# EAGLE design ai_breakout_adns3080 (EAGLE 6.5.0)
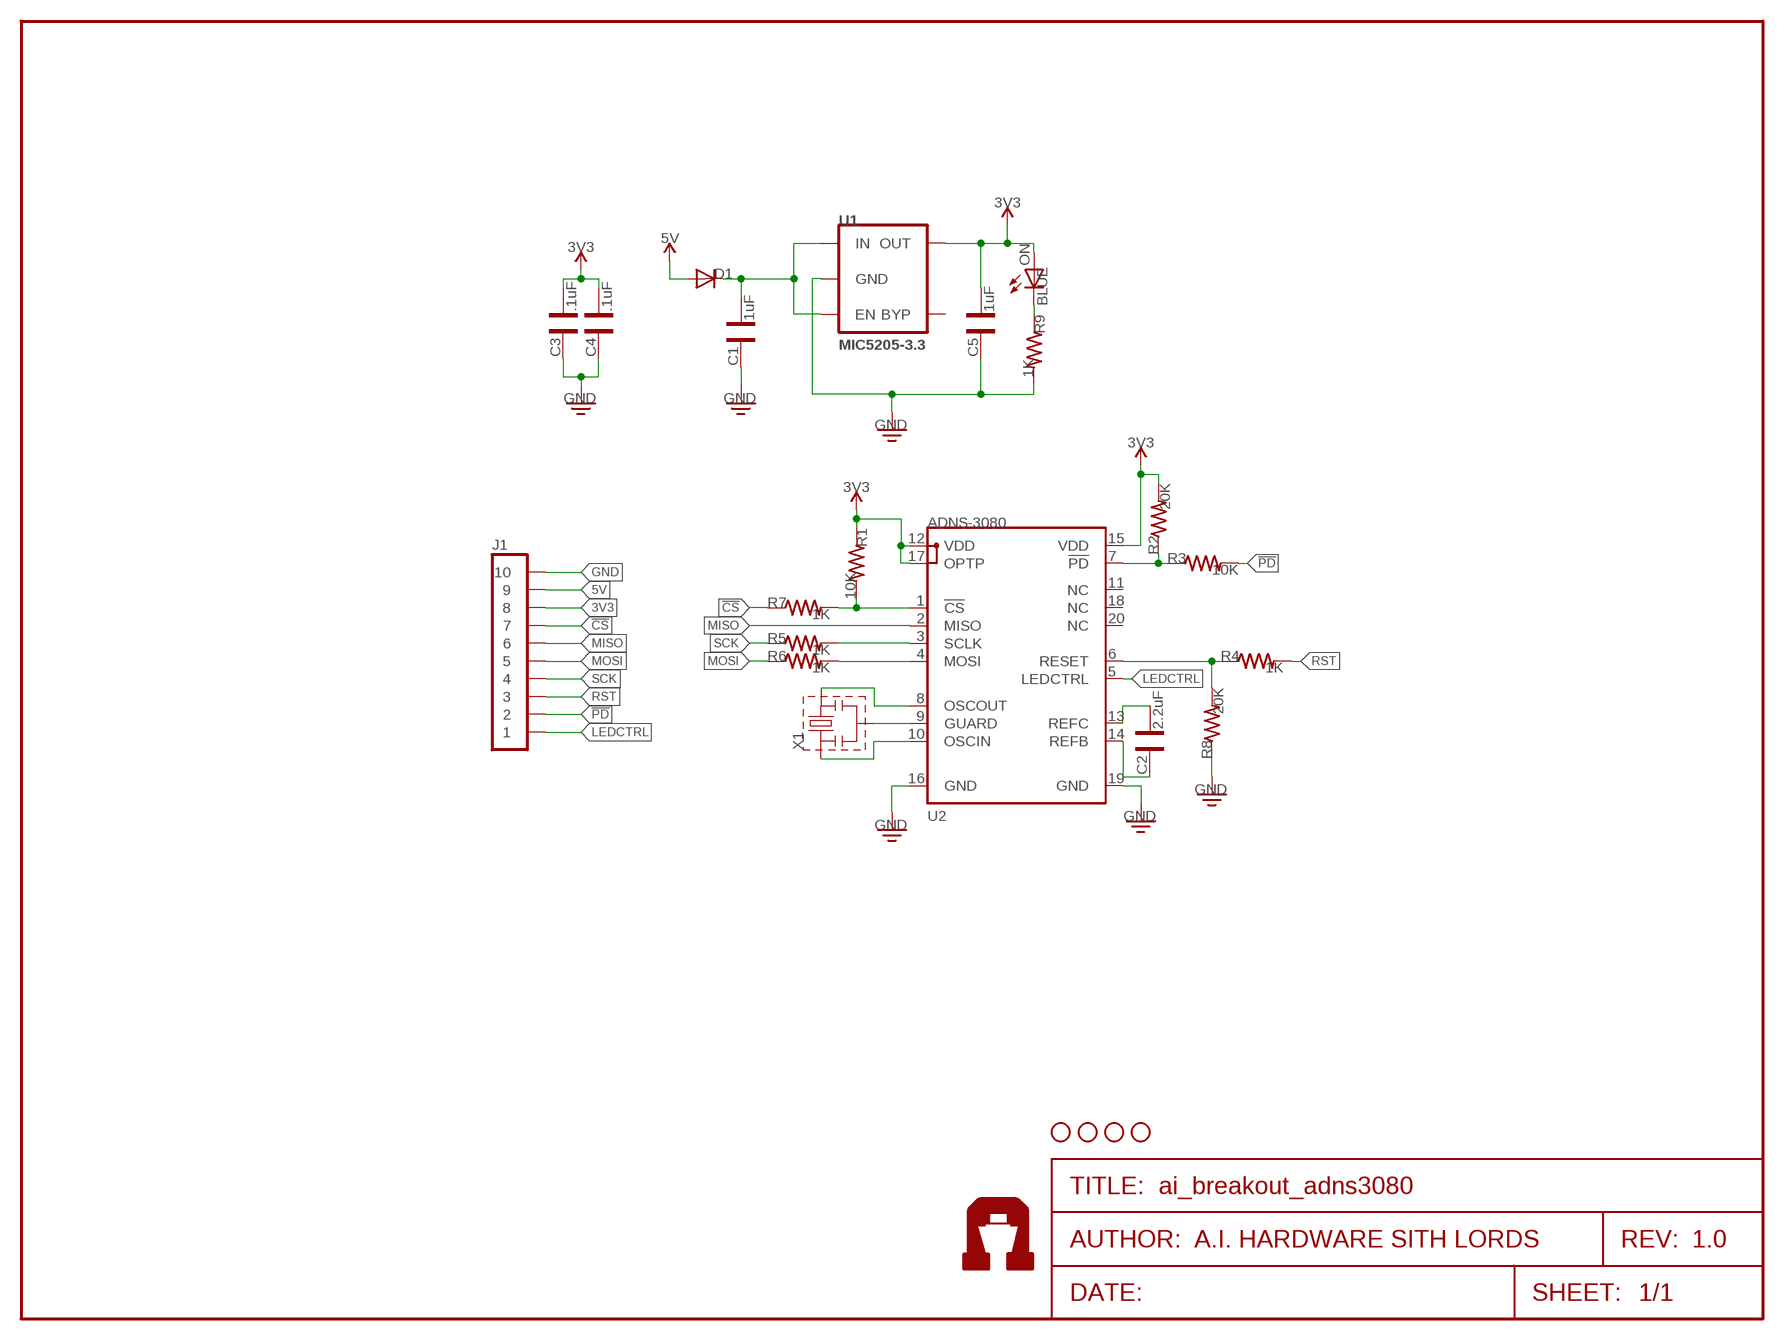
[diagram p0: schematic, sheet 1]
FRAME1 (FRAME-LETTER): AUTHOR: A.I. HARDWARE SITH LORDS; REV: 1.0

## Parts
C1  1uF  CAP0603  [CAP-0603]
C2  2.2uF  CAP0603  [CAP-0603]
C3  .1uF  CAP0603  [CAP-0603]
C4  .1uF  CAP0603  [CAP-0603]
C5  1uF  CAP0603  [CAP-0603]
D1  DIODESMA-403D  [SMA-403D]
J1  1X10  [1X10]
ON  BLUE  LED0603  [LED-0603]
R1  10K  RES0603  [RES-0603]
R2  20K  RES0603  [RES-0603]
R3  10K  RES0603  [RES-0603]
R4  1K  RES0603  [RES-0603]
R5  1K  RES0603  [RES-0603]
R6  1K  RES0603  [RES-0603]
R7  1K  RES0603  [RES-0603]
R8  20K  RES0603  [RES-0603]
R9  1K  RES0603  [RES-0603]
STANDOFF1  STAND-OFF  [STAND-OFF]
STANDOFF2  STAND-OFF  [STAND-OFF]
STANDOFF3  STAND-OFF  [STAND-OFF]
STANDOFF4  STAND-OFF  [STAND-OFF]
U1  MIC5205-3.3  [SOT23-5]
U2  ADNS-3080  [ADNS-3080]
U$2  AI-LOGOM  [AI-LOGO-M]
U$3  AI-LOGOM  [AI-LOGO-M]
X1  RESON025X020  [RESON-SMD-025X020]

## Nets
3V3: C3.1 C4.1 C5.1 J1.8 ON.A R1.1 R2.2 U1.5(OUT) U2.12(VDD) U2.15(VDD) U2.17(OPTP)
5V: D1.A J1.9
!CS: J1.7 R7.1
!PD: J1.2 R3.2
GND: C1.2 C3.2 C4.2 C5.2 J1.10 R8.1 R9.2 U1.2(GND) U2.16(GND) U2.19(GND)
LEDCTRL: J1.1 U2.5(LEDCTRL)
MISO: J1.6 U2.2(MISO)
MOSI: J1.5 R6.1
N$1: C1.1 D1.C U1.1(IN) U1.3(EN)
N$2: U2.9(GUARD) X1.2
N$3: U2.8(OSCOUT) X1.3
N$4: R1.2 R7.2 U2.1(!CS)
N$5: R5.2 U2.3(SCLK)
N$6: U2.10(OSCIN) X1.1
N$7: R2.1 R3.1 U2.7(!PD)
N$10: R6.2 U2.4(MOSI)
N$12: R4.1 R8.2 U2.6(RESET)
N$16: C2.1 U2.13(REFC)
N$17: C2.2 U2.14(REFB)
N$26: ON.C R9.1
RST: J1.3 R4.2
SCK: J1.4 R5.1
Unconnected: U1.4(BYP) U2.11(NC) U2.18(NC) U2.20(NC)

## Library data of the parts
C1-C5 = Ai_Passives:CAP
D1 = Ai_DiscreteSemis:DIODE
J1 = Ai_Connectors:1X10
ON = Ai_LED:LED
R1-R9 = Ai_Passives:RES
STANDOFF1-STANDOFF4 = Ai_Electromechanical:STAND-OFF: #4 Stand Off This is the mechanical footprint for a #4 phillips button head screw. Use the keepout ring to avoid running the screw head into surrounding components.
U1 = Ai_Power:MIC5205-*: Fixed-Voltage Regulator Standard voltage regulator in SOT23-5 layout. Micrel part MIC5205x.x where x.x designates the output voltage (e.g., 3.3). BYP pin is used to lower output noise with 470pF cap. Haven't tested the footprint on an actual board yet!
U2 = Ai_IC:ADNS-3080
U$2 U$3 = Ai_Miscellany:AI-LOGO
X1 = Ai_Passives:RESON

## Net classes
0 default: width 0.305 mm
1 power: width 0.406 mm

## Board
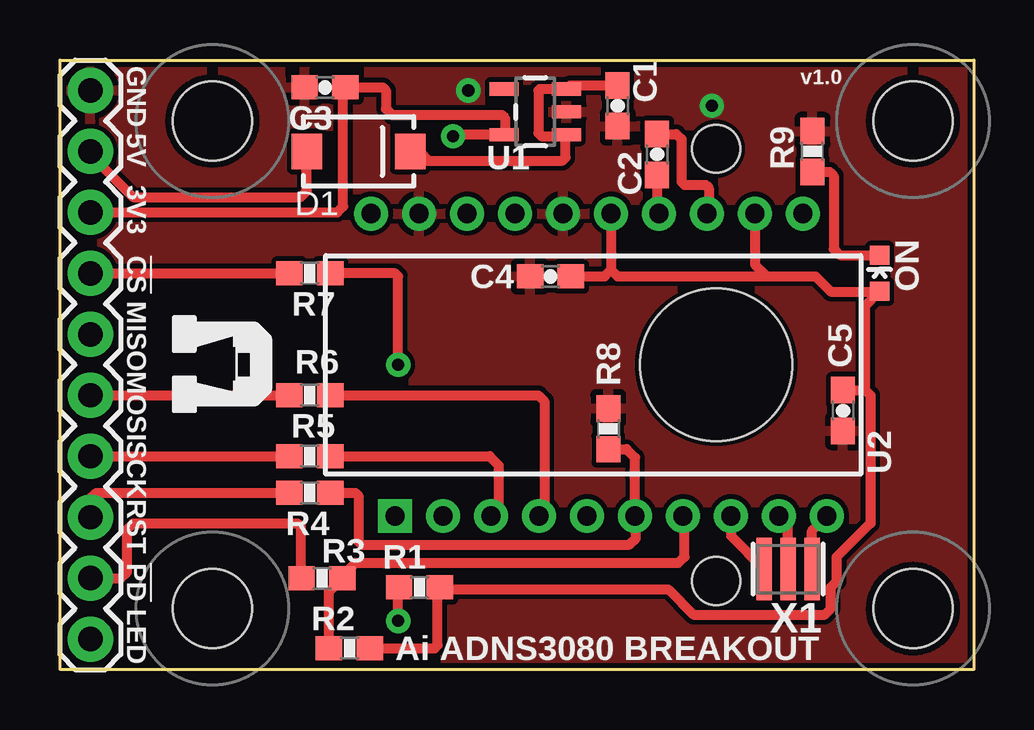
[diagram p1: board, top side]
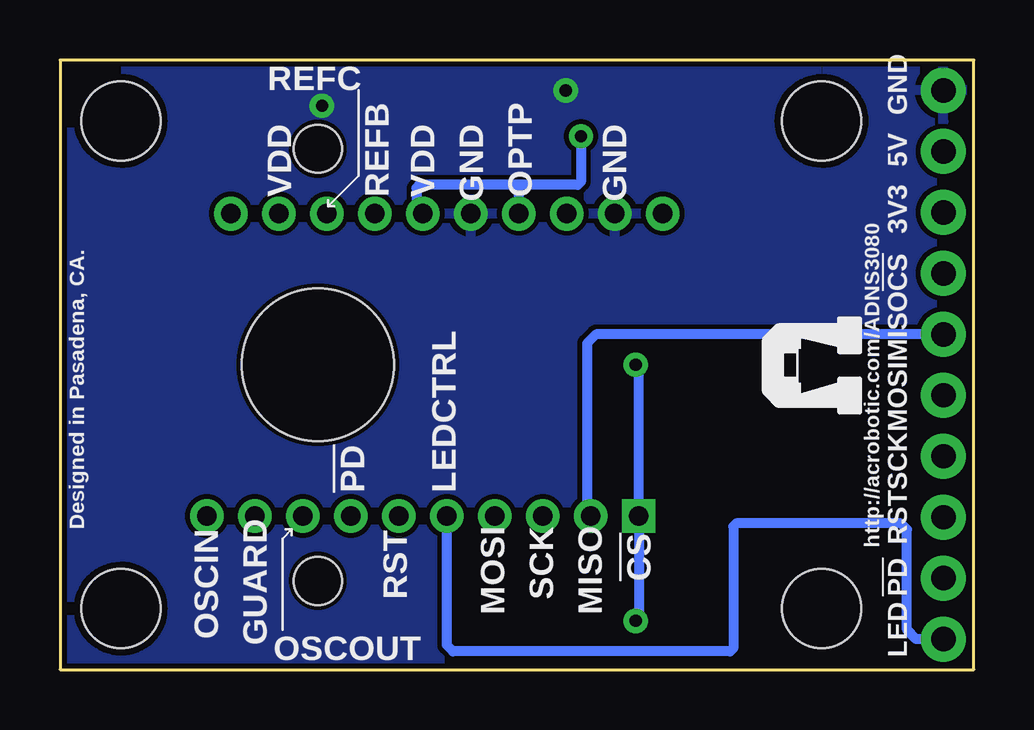
[diagram p2: board, bottom side, seen from below]

Size 38.1 x 25.4 mm. Coordinates in mm from the lower left corner, seen from the top.
Outline: 0,0 0,25.4 38.1,25.4 38.1,0 0,0
Copper layers (1*16): Top 0.035mm / dielectric 1.5mm / Bottom 0.035mm
Design rules "ai_2layer": minimum track width 7mil, minimum drill 15mil, track to track 8mil, track to pad 8mil, pad to pad 8mil, via to via 8mil, smd to smd 8mil, copper to edge 8mil, drill to drill 8mil, minimum pad ring 12mil, minimum via ring 10mil, stop-mask expansion 4mil, vias tented up to drill 20mil, thermal gap 10mil

### Footprints (pad centres in the part's own frame; a part is rotated, then mirrored left to right if it is on the bottom)
CAP-0603 = smd 1.1 x 1: 1 -0.85,0; 2 0.85,0
SMA-403D = smd 1.27 x 1.47: A -2.15,0; C 2.15,0
1X10 = drill 1.016 pad 1.88: 1 -11.43,0; 2 -8.89,0; 3 -6.35,0; 4 -3.81,0; 5 -1.27,0; 6 1.27,0; 7 3.81,0; 8 6.35,0; 9 8.89,0; 10 11.43,0
LED-0603 = smd 0.8 x 0.8: A 0,-0.75; C 0,0.75
RES-0603 = smd 1.1 x 1: 1 -0.85,0; 2 0.85,0
STAND-OFF = hole 3.302: 0,0
SOT23-5 = smd 0.55 x 1.2: 1 -0.95,-1.3; 2 0,-1.3; 3 0.95,-1.3; 4 0.95,1.3; 5 -0.95,1.3
ADNS-3080 = drill 0.8 square: 1 -8.126,-6.3 | drill 0.8: 2 -6.126,-6.3; 3 -4.126,-6.3; 4 -2.126,-6.3; 5 -0.126,-6.3; 6 1.874,-6.3; 7 3.874,-6.3; 8 5.874,-6.3; 9 7.874,-6.3; 10 9.874,-6.3; 11 8.874,6.3; 12 6.874,6.3; 13 4.874,6.3; 14 2.874,6.3; 15 0.874,6.3; 16 -1.126,6.3; 17 -3.126,6.3; 18 -5.126,6.3; 19 -7.126,6.3; 20 -9.126,6.3 | hole 6.35: 5.254,0 | hole 2: 5.254,-9; 5.254,9
RESON-SMD-025X020 = smd 0.65 x 2.6: 1 -1,0; 2 0,0; 3 1,0

### Placement (x,y rotation side)
C1  23.24,23.5 270 top
C2  24.89,21.46 270 top
C3  11.05,24.26 180 top
C4  20.45,16.38 180 top
C5  32.64,10.79 270 top
D1  12.45,21.59 0 top
J1  1.27,12.7 90 top
ON  34.16,16.51 0 top
R1  14.99,3.43 180 top
R2  12.06,0.89 0 top
R3  10.92,3.81 180 top
R4  10.41,7.37 180 top
R5  10.41,8.89 0 top
R6  10.41,11.43 0 top
R7  10.41,16.51 0 top
R8  22.86,10.03 270 top
R9  31.37,21.59 90 top
STANDOFF1  6.35,22.86 0 top
STANDOFF2  6.35,2.54 0 top
STANDOFF3  35.56,22.86 0 top
STANDOFF4  35.56,2.54 0 top
U1  19.81,23.24 90 top
U2  22.1,12.7 0 top
U$2  4.57,14.86 270 top
U$3  4.57,10.54 90 bottom
X1  30.35,4.19 180 top

### Tracks (layer width: path | path; a pad name or v marks a point on that pad's centre or on a via)
3V3  (via drill 0.51)
  Top 0.406: 15.75,3.34 15.75,1.02 15.62,0.89 R2.2 | 15.75,3.34 25.36,3.34 26.42,2.29 31.88,2.29 32.13,2.54 32.13,3.43 32.38,3.68 32.38,4.7 33.78,6.1 33.78,11.43 33.57,11.64 | J1.8 11.56,19.05 11.81,19.3 11.81,24.22 C3.1 13.46,24.26 13.59,24.13 13.59,23.37 13.84,23.11 18.41,23.11 18.54,22.99 18.54,22.32 U1.5 16.45,22.29 v16.38,22.23 | U2.15 22.97,16.65 | 22.97,16.65 23.24,16.38 29.46,16.38 | 29.46,16.38 31.5,16.38 32.13,15.75 34.15,15.75 ON.A 33.57,15.16 33.57,11.64 | C5.1 33.57,11.64 | U2.12 28.97,16.88 29.46,16.38 | 15.75,3.34 R1.1 | C4.1 22.7,16.38 22.97,16.65
  Bottom 0.406: v16.38,22.23 16.38,20.32 16.51,20.19 18.92,20.19 | 18.92,20.19 23.11,20.19 23.24,20.07 23.24,19.02 U2.15 | U2.17 18.97,20.14 18.92,20.19
5V
  Top 0.406: J1.9 1.27,21.46 3.05,19.68 10.03,19.68 10.29,19.94 10.29,21.58 D1.A
!CS
  Top 0.406: J1.7 R7.1
!PD
  Top 0.406: J1.2 2.54,3.81 2.79,4.06 2.79,5.84 3.05,6.1 9.91,6.1 10.03,5.97 10.03,3.85 R3.2
GND  (via drill 0.51)
  other vias: 17.02,24.13 27.18,23.5
  pour Bottom: 0,25.4 38.1,25.4 38.1,0 0,0
  pour Top: 0,25.4 38.1,25.4 38.1,0 0,0
LEDCTRL
  Bottom 0.406: U2.5 21.97,6.14 21.97,1.02 21.72,0.76 10.16,0.76 10.03,0.89 10.03,5.97 9.91,6.1 3.05,6.1 2.79,5.84 2.79,1.65 2.41,1.27 J1.1
MISO
  Bottom 0.406: J1.6 15.75,13.97 16.13,13.59 16.13,6.5 U2.2
MOSI
  Top 0.406: J1.5 R6.1
N$1
  Top 0.406: C1.1 21.27,24.34 U1.3 20,24.19 19.94,24.13 19.94,22.35 20.07,22.23 21.05,22.23 U1.1 21.08,22.26 21.08,21.34 20.95,21.21 15.37,21.21 | 14.22,21.21 15.37,21.21 | D1.C 14.99,21.59 15.37,21.21
N$2
  Top 0.406: X1.2 30.35,6.02 U2.9
N$3
  Top 0.406: U2.8 27.97,5.57 X1.3
N$4  (via drill 0.51)
  Top 0.406: v14.1,2.03 14.1,3.39 R1.2 | v14.1,12.7 14.1,16.38 13.97,16.51 R7.2
  Bottom 0.406: v14.1,2.03 13.97,2.16 U2.1 13.97,12.57 v14.1,12.7
N$5
  Top 0.406: R5.2 17.91,8.89 18.29,8.51 18.29,6.72 U2.3
N$6
  Top 0.406: X1.1 31.35,5.78 U2.10
N$7
  Top 0.406: R2.1 11.21,3.25 R3.1 11.77,3.9 12.32,4.45 25.78,4.45 26.04,4.7 26.04,6.34 U2.7
N$10
  Top 0.406: R6.2 19.94,11.43 20.19,11.18 20.19,6.69 U2.4
N$12
  Top 0.406: R4.1 12.32,7.37 12.45,7.24 12.45,5.33 12.57,5.21 23.75,5.21 24,5.46 24,6.37 U2.6 23.97,8.83 23.62,9.18 R8.2
N$16
  Top 0.406: C2.1 25.69,22.31 25.91,22.1 25.91,20.32 26.04,20.19 26.92,20.19 27.05,20.07 27.05,19.08 U2.13
N$17
  Top 0.406: C2.2 24.89,19.08 U2.14
N$26
  Top 0.406: R9.1 32.09,20.74 32.26,20.57 32.26,17.53 32.51,17.27 34.15,17.27 ON.C
RST
  Top 0.406: J1.3 1.27,7.11 1.52,7.37 R4.2
SCK
  Top 0.406: J1.4 R5.1

### Text on the board
tPlace: GND | v1.0 | 5V | 3V3 | !CS | MISO | MOSI | SCK | RST | !PD | LED | Ai ADNS3080 BREAKOUT
bPlace: REFC | OPTP | REFB | GND | GND | GND | VDD | VDD | 5V | 3V3 | !CS | MISO | MOSI | SCK | LEDCTRL | !PD | Designed in Pasadena, CA. | RST | http://acrobotic.com/ADNS3080 | !CS | !PD | SCK | RST | MISO | MOSI | LED | GUARD | OSCIN | OSCOUT